# EAGLE schematic CAP-HOST (EAGLE 9.6.2)
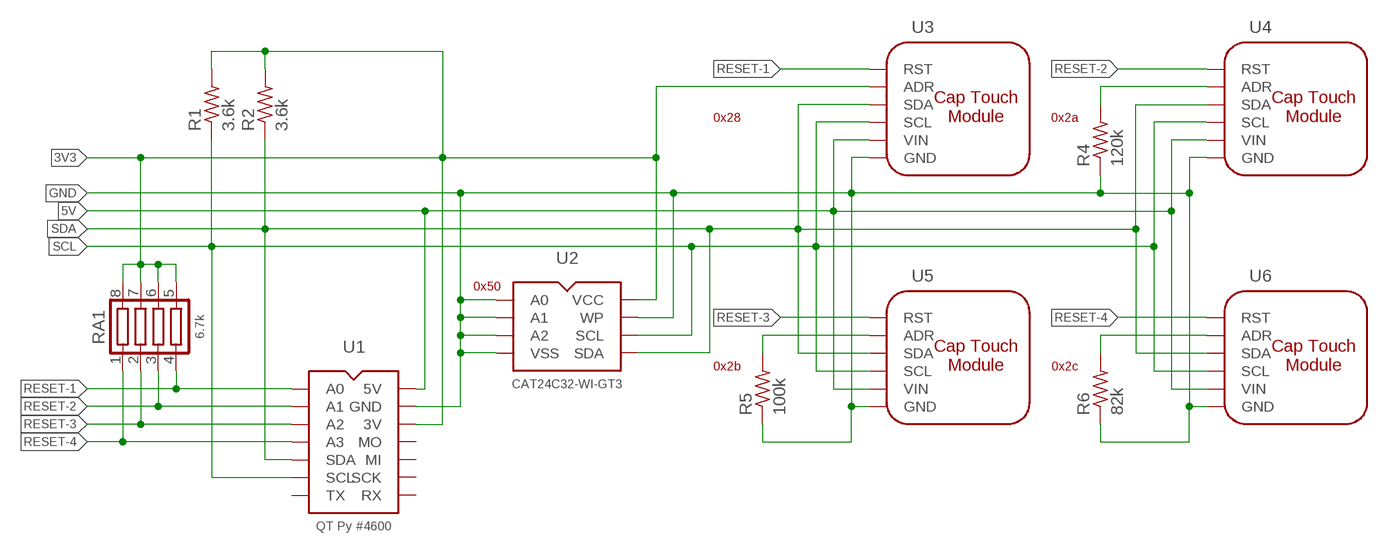
[diagram p0: schematic, sheet 1]

## Parts
R1  3.6k  R-US_R1206  [R1206]
R2  3.6k  R-US_R1206  [R1206]
R4  120k  R-US_R1206  [R1206]
R5  100k  R-US_R1206  [R1206]
R6  82k  R-US_R1206  [R1206]
RA1  6.7k  RES-ARRAY-1206  [RES-NET-1206]
U1  QT Py #4600  QT_PY-CASTL  [QT_PY-CASTL]
U2  CAT24C32-WI-GT3  EEPROM-I2C-CAT24C32-WI-GT3  [SOIC-8-ON]
U3  CAP-SENSOR-INTF  [CAP-TOUCH-MODULE-2]
U4  CAP-SENSOR-INTF  [CAP-TOUCH-MODULE-2]
U5  CAP-SENSOR-INTF  [CAP-TOUCH-MODULE-2]
U6  CAP-SENSOR-INTF  [CAP-TOUCH-MODULE-2]

## Nets
3V3 [8 mil]: R1.2 R2.2 RA1.5 RA1.6 RA1.7 RA1.8 U1.3V3(3V) U2.P$8(VCC) U3.ADR
5V [8 mil]: U1.5V U3.VIN U4.VIN U5.VIN U6.VIN
GND [8 mil]: R4.1 R5.1 R6.1 U1.GND U2.P$1(A0) U2.P$2(A1) U2.P$3(A2) U2.P$4(VSS) U2.P$7(WP) U3.GND U4.GND U5.GND U6.GND
N$2 [8 mil]: R5.2 U5.ADR
N$4 [8 mil]: R6.2 U6.ADR
N$7 [8 mil]: R4.2 U4.ADR
RESET-1 [8 mil]: RA1.4 U1.A0 U3.RST
RESET-2 [8 mil]: RA1.3 U1.A1 U4.RST
RESET-3 [8 mil]: RA1.2 U1.A2 U5.RST
RESET-4 [8 mil]: RA1.1 U1.A3 U6.RST
SCL [8 mil]: R1.1 U1.SCL U2.P$6(SCL) U3.SCL U4.SCL U5.SCL U6.SCL
SDA [8 mil]: R2.1 U1.SDA U2.P$5(SDA) U3.SDA U4.SDA U5.SDA U6.SDA
Unconnected: U1.MISO(MI) U1.MOSI(MO) U1.RX U1.SCLK(SCK) U1.TX

## Notes on the sheet
- 0x28 | 0x2a
- 0x50
- 0x2b | 0x2c

## Library data of the parts
R1 R2 R4-R6 = home:R-US_: RESISTOR, American symbol
RA1 = home:RES-ARRAY
U1 = home:QT_PY: Adafruit QT Py SAMD21 product #4600.
U2 = home:EEPROM-I2C
U3-U6 = home:CAP-SENSOR-INTF

## Net classes
1 8 mil: width 0.203 mm